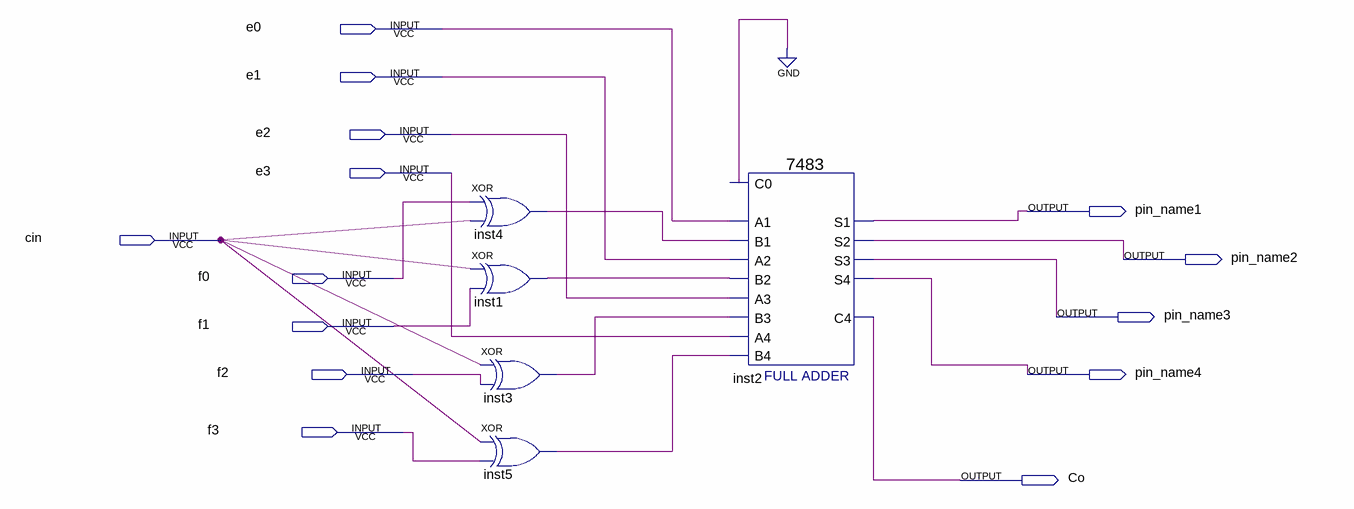
[diagram p0: schematic sheet]
// Quartus schematic addsub.bdf as structural Verilog: 5 symbols, 14 pins
module addsub (
  input  e0,
  input  e1,
  input  e2,
  input  e3,
  input  cin,
  input  f0,
  input  f1,
  input  f2,
  input  f3,
  output pin_name1,
  output pin_name2,
  output pin_name3,
  output pin_name4,
  output Co
);

  wire inst1_out, inst3_out, inst4_out, inst5_out;

  xor inst4 (inst4_out, f0, cin);
  xor inst1 (inst1_out, cin, f1);
  xor inst3 (inst3_out, cin, f2);
  xor inst5 (inst5_out, cin, f3);
  \7483  inst2 (
    .B4(inst5_out), .C0(1'b0), .A1(e0), .A2(e1), .B1(inst4_out), .B2(inst1_out), .A3(e2), .B3(inst3_out),
    .A4(e3), .S3(pin_name3), .S4(pin_name4), .S2(pin_name2), .C4(Co), .S1(pin_name1));
endmodule
